# Altium schematic sheet Sheet1.SchDoc
size A4; SheetNumber: 1; SheetTotal: 1
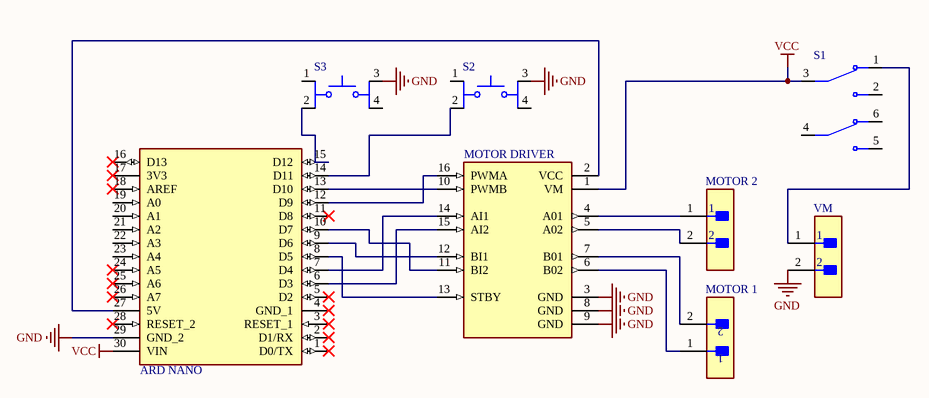
[diagram p0: Sheet1.SchDoc]

## Parts
ARD_NANO  A000005  [MODULE_A000005]  (value not drawn)
MOTOR_1  TSW-102-12-T-S  [FP-TSW-102-12-T-S-MFG]  (value not drawn)
MOTOR_2  TSW-102-12-T-S  [FP-TSW-102-12-T-S-MFG]  (value not drawn)
MOTOR_DRIVER  (no value)  [MODULE_ROB-14450]
S1  TL2285OA  [SW_TL2285OA]  (value not drawn)
S2  TL1105AF160Q  [SW_TL1105AF160Q]  (value not drawn)
S3  TL1105AF160Q  [SW_TL1105AF160Q]  (value not drawn)
VM  TSW-102-12-T-S  [FP-TSW-102-12-T-S-MFG]  (value not drawn)

## Nets
GND: ARD_NANO.29(GND_2) MOTOR_DRIVER.3(GND) MOTOR_DRIVER.8(GND) MOTOR_DRIVER.9(GND) S2.3 S3.3 VM.2
VCC: ARD_NANO.30(VIN) MOTOR_DRIVER.1(VM) S1.3(COM1)
NetARD_NANO_6: ARD_NANO.6(D3) MOTOR_DRIVER.15(AI2)
NetARD_NANO_7: ARD_NANO.7(D4) MOTOR_DRIVER.14(AI1)
NetARD_NANO_8: ARD_NANO.8(D5) MOTOR_DRIVER.13(STBY)
NetARD_NANO_9: ARD_NANO.9(D6) MOTOR_DRIVER.12(BI1)
NetARD_NANO_10: ARD_NANO.10(D7) MOTOR_DRIVER.11(BI2)
NetARD_NANO_12: ARD_NANO.12(D9) MOTOR_DRIVER.16(PWMA)
NetARD_NANO_13: ARD_NANO.13(D10) MOTOR_DRIVER.10(PWMB)
NetARD_NANO_14: ARD_NANO.14(D11) S2.2
NetARD_NANO_15: ARD_NANO.15(D12) S3.2
NetARD_NANO_27: ARD_NANO.27(5V) MOTOR_DRIVER.2(VCC)
NetMOTOR_1_1: MOTOR_1.1 MOTOR_DRIVER.6(B02)
NetMOTOR_1_2: MOTOR_1.2 MOTOR_DRIVER.7(B01)
NetMOTOR_2_1: MOTOR_2.1 MOTOR_DRIVER.4(A01)
NetMOTOR_2_2: MOTOR_2.2 MOTOR_DRIVER.5(A02)
NetS1_1: S1.1(NC1) VM.1

Not connected (* = marked no-connect by the designer): ARD_NANO 1(D0/TX)* 2(D1/RX)* 3(RESET_1)* 4(GND_1)* 5(D2)* 11(D8)* 16(D13)* 17(3V3)* 18(AREF)* 19(A0) 20(A1) 21(A2) 22(A3) 23(A4) 24(A5)* 25(A6)* 26(A7)* 28(RESET_2)*; S1 2(NO1) 4(COM2) 5(NO2) 6(NC2); S2 1 4; S3 1 4

## Library data of the parts
ARD_NANO = A000005: Arduino Nano Mikrodenetleyici KartÄ±, ATmega328 ¦ Arduino A000005; SnapEDA_Link: https://www.snapeda.com/parts/A000005/Arduino/view-part/?ref=snap; Package: Non-Standard Arduino; Value: *; MF: Arduino; MP: A000005; Check_prices: https://www.snapeda.com/parts/A000005/Arduino/view-part/?ref=eda
MOTOR_1 MOTOR_2 VM = CMP-02766-001444-1: CONN HEADER VERT 2POS 2.54MM; Gender: Male; Number of Contacts: 2; RoHS Compliant: Yes; Mount: Through Hole; Termination: Solder; Packaging: Bulk; Contact Material: Bronze; Contact Plating: Tin; Number of Rows: 1; REACH SVHC: No SVHC; Pitch: 2.54mm; Radiation Hardening: No
MOTOR_DRIVER = ROB-14450: TB6612FNG Motor Controller/Driver Power Management Evaluation Board; MF: SparkFun Electronics; Check_prices: https://www.snapeda.com/parts/ROB-14450/SparkFun%20Electronics/view-part/2656367/?ref=eda; Package: None; MP: ROB-14450; Value: *; Availability: In Stock; SnapEDA_Link: https://www.snapeda.com/parts/ROB-14450/SparkFun%20Electronics/view-part/2656367/?ref=snap; Price: None
S1 = TL2285OA: Pushbutton Switch, TL2285, DPDT, ON-(ON), Plunger for Cap, 100mA, 30VDC,PC Pin | E-Switch TL2285OA; SnapEDA_Link: https://www.snapeda.com/parts/TL2285OA/E-Switch/view-part/?ref=snap; Package: None; Value: *; MF: E-Switch; MP: TL2285OA; Check_prices: https://www.snapeda.com/parts/TL2285OA/E-Switch/view-part/?ref=eda
S2 S3 = TL1105AF160Q: Tactile Switch SPST-NO Top Actuated Through Hole; MF: E-Switch; SnapEDA_Link: https://www.snapeda.com/parts/TL1105AF160Q/E-Switch/view-part/?ref=snap; Package: None; Value: *; MP: TL1105AF160Q; Check_prices: https://www.snapeda.com/parts/TL1105AF160Q/E-Switch/view-part/?ref=eda